# Altium project AD5941 Module.PrjPcb
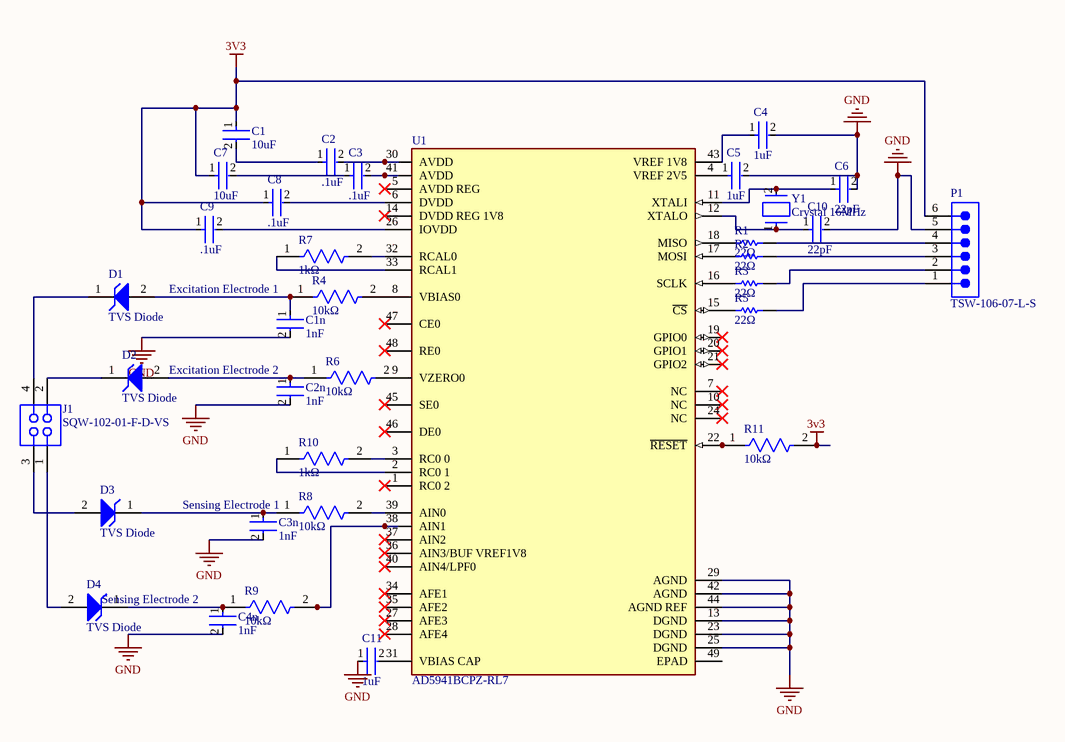
[diagram p0: AD5941 Module.SchDoc]
1 sheet, 34 parts. Net scope: global (net labels, ports and power ports of the same name join across sheets).
Board file: PCB1.PcbDoc

## Sheet AD5941 Module.SchDoc
size A; SheetNumber: 1; SheetTotal: 1

### Parts
C1  10uF  [FP-CC0603-DB-MFG]
C1n  1nF  [FP-0805-L_2_01_0_2-W_1_25-IPC_A]
C2  .1uF  [FP-C0402-BB-MFG]
C2n  1nF  [FP-0805-L_2_01_0_2-W_1_25-IPC_A]
C3  .1uF  [FP-C0402-BB-MFG]
C3n  1nF  [FP-0805-L_2_01_0_2-W_1_25-IPC_A]
C4  1uF  [FP-C0402C105K8PACTU-MFG]
C4n  1nF  [FP-0805-L_2_01_0_2-W_1_25-IPC_A]
C5  1uF  [FP-C0402C105K8PACTU-MFG]
C6  22pF  [FP-C1206C-EB-MFG]
C7  10uF  [FP-CC0603-DB-MFG]
C8  .1uF  [FP-C0402-BB-MFG]
C9  .1uF  [FP-C0402-BB-MFG]
C10  22pF  [FP-C1206C-EB-MFG]
C11  1uF  [FP-C0402C105K8PACTU-MFG]
D1  TVS Diode  [ONSC-SOD-923-2-514AB-01_V]
D2  TVS Diode  [ONSC-SOD-923-2-514AB-01_V]
D3  TVS Diode  [ONSC-SOD-923-2-514AB-01_V]
D4  TVS Diode  [ONSC-SOD-923-2-514AB-01_V]
J1  SQW-102-01-F-D-VS  [SMTC-SQW-102-01-X-D-VS]
P1  TSW-106-07-L-S  [SMTC-TSW-106-07-X-S]
R1  22Ω  [RESC3216X60X45LL10T20]
R2  22Ω  [RESC3216X60X45LL10T20]
R3  22Ω  [RESC3216X60X45LL10T20]
R4  10kΩ  [FP-RT0603-MFG]
R5  22Ω  [RESC3216X60X45LL10T20]
R6  10kΩ  [FP-RT0603-MFG]
R7  1kΩ  [FP-RG3216-MFG]
R8  10kΩ  [FP-RT0603-MFG]
R9  10kΩ  [FP-RT0603-MFG]
R10  1kΩ  [FP-RG3216-MFG]
R11  10kΩ  [FP-RT0603-MFG]
U1  AD5941BCPZ-RL7  [FP-CP-48-4-IPC_C]
Y1  Crystal 16MHz  [FP-ABM7-MFG]

### Nets
3V3: C1.1 C7.1 C8.1 C9.1 P1.6 R11.2
GND: C1n.2 C2n.2 C3n.2 C4.2 C4n.2 C5.2 C6.2 C10.2 C11.1 P1.5 U1.13(DGND) U1.23(DGND) U1.25(DGND) U1.29(AGND) U1.42(AGND) U1.44(AGND_REF)
NetC1_2: C1.2 C2.1
NetC1n_1: C1n.1 D1.2(A) R4.1
NetC2_2: C2.2 U1.30(AVDD)
NetC2n_1: C2n.1 D2.2(A) R6.1
NetC3_1: C3.1 C7.2
NetC3_2: C3.2 U1.41(AVDD)
NetC3n_1: C3n.1 D3.1(K) R8.1
NetC4_1: C4.1 U1.43(VREF_1V8)
NetC4n_1: C4n.1 D4.1(K) R9.1
NetC5_1: C5.1 U1.4(VREF_2V5)
NetC6_1: C6.1 U1.11(XTALI) Y1.2
NetC8_2: C8.2 U1.6(DVDD)
NetC9_2: C9.2 U1.26(IOVDD)
NetC10_1: C10.1 U1.12(XTALO) Y1.1
NetC11_2: C11.2 U1.31(VBIAS_CAP)
NetD1_1: D1.1(K) J1.4
NetD2_1: D2.1(K) J1.2
NetD3_2: D3.2(A) J1.3
NetD4_2: D4.2(A) J1.1
NetP1_1: P1.1 R5.2
NetP1_2: P1.2 R3.2
NetP1_3: P1.3 R2.2
NetP1_4: P1.4 R1.2
NetR1_1: R1.1 U1.18(MISO)
NetR2_1: R2.1 U1.17(MOSI)
NetR3_1: R3.1 U1.16(SCLK)
NetR4_2: R4.2 U1.8(VBIAS0)
NetR5_1: R5.1 U1.15(~{CS})
NetR7_1: R7.1 U1.33(RCAL1)
NetR7_2: R7.2 U1.32(RCAL0)
NetR8_2: R8.2 U1.39(AIN0)
NetR9_2: R9.2 U1.38(AIN1)
NetR10_1: R10.1 U1.2(RC0_1)
NetR10_2: R10.2 U1.3(RC0_0)
NetR11_1: R11.1 U1.22(~{RESET})

Not connected (* = marked no-connect by the designer): R6 2; U1 1(RC0_2)* 5(AVDD_REG)* 7(NC)* 9(VZERO0) 10(NC)* 14(DVDD_REG_1V8)* 19(GPIO0)* 20(GPIO1)* 21(GPIO2)* 24(NC)* 27(AFE3)* 28(AFE4)* 34(AFE1)* 35(AFE2)* 36(AIN3/BUF_VREF1V8)* 37(AIN2)* 40(AIN4/LPF0)* 45(SE0)* 46(DE0)* 47(CE0)* 48(RE0)* 49(EPAD)

### Notes on the sheet
- Excitation Electrode 1
- (near C2n) Excitation Electrode 2
- Sensing Electrode 1
- (near D4) Sensing Electrode 2

### Library data of the parts
C1 C7 = CMP-1035-02797-2: CAP CER 10UF 6.3V X5R 0603; Dissipation Factor: 10%; Tolerance: 20%; Depth: 0.8mm; Dielectric: X5R; Height: 0.8mm; Min Operating Temperature: -55°C; Package Quantity: 4000; Radiation Hardening: No; Mount: Surface Mount; Termination: SMD/SMT; Case/Package: 0603; Max Operating Temperature: 85°C; Case Code (Imperial): 0603; RoHS Compliant: Yes; Number of Pins: 2; Lead Free: Lead Free; Resistor Type: Ceramic; Thickness: 0.039inch; Construction: Flat; Width: 0.031inch; Length: 1.6mm; Capacitance: 10uF; Voltage Rating: 6.3V; Series: CC; REACH SVHC: No SVHC; Packaging: Tape and Reel; Case Code (Metric): 1608; Voltage Rating (DC): 6.3V; Halogen Free: Halogen Free
C1n C2n C3n C4n = CMP-2007-04595-2: General Purpose Ceramic Capacitor, 0805, 1nF, 10%, X7R, 0.15, 200V; Insulation Resistance: 100GR; Lead Free: Lead Free; Height: 0.71mm; Voltage Rating: 200V; REACH SVHC: No SVHC; Mount: Surface Mount; RoHS Compliant: Yes; Thickness: 0.037inch; Package Quantity: 1; Series: -; Size: 0.94mm; Case/Package: 0805; Dielectric: X7R; Radiation Hardening: No; Construction: Flat; Length: 2.01mm; Width: 0.049inch; Contact Plating: Tin; Case Code (Imperial): 0805; Termination: SMD/SMT; Case Code (Metric): 2012; Number of Pins: 2; Dielectric Material: Ceramic; Packaging: Tape and Reel; Capacitance: 1nF; Min Operating Temperature: -55°C; Depth: 1.25mm; Voltage: 200V; Max Operating Temperature: 125°C; Tolerance: 10%; Voltage Rating (DC): 200V
C2 C3 C8 C9 = CMP-2008-02046-2: CAP CER 0.1UF 10V X5R 0402; Manufacturer: Kemet; Manufacturer Part Number: C0402C104K8PACTU; Material: Ceramic; Capacitance: 0.10 μF; Temperature Coefficient: 15%; Description: C0402 0.10 μF X5R 10.00% 10 V; Tolerance: 0.1; Value: 0.10 μF; Package: C0402-BB; Temperature: -55°C to +125°C; ComponentLink2Description: Datasheet; Temperature Characteristic: X5R; Device Class L1: Passive Components; Height: 0.55mm; Lead Free: Yes; ComponentLink2URL: https://content.kemet.com/datasheets/KEM_C1002_X7R_SMD.pdf; Device Class L2: Capacitors; Temperature Range Low: -55°C; Temperature Range High: +125°C; RoHS: TRUE; Octopart: https://octopart.com/c0402c104k8pactu-kemet-140039; Automotive: No; Mouser Description: Capacitor 100 nF 10 VDC 0402; Category: Cap; Voltage Rating: 10 V; Digikey Description: CAP CER 0.1UF 10V X5R 0402; Ipc Land Pattern Name: CAPC10050X50; Device Class L3: Ceramic Capacitors
C4 C5 C11 = CMP-2008-02081-2: CAP CER 1UF 10V X5R 0402; Dielectric Material: Ceramic; Dissipation Factor: 5%; Tolerance: 10%; Number of Pins: 2; Contact Plating: Tin; Min Operating Temperature: -55°C; Termination: SMD/SMT; Lead Free: Lead Free; Construction: Flat; Voltage Rating (DC): 10V; Mount: Surface Mount; Series: C; Thickness: 0.022inch; Width: 0.5mm; Radiation Hardening: No; Capacitance: 1uF; Dielectric: X5R; Height: 0.5mm; Voltage: 10V; Length: 1mm; Depth: 0.5mm; Max Operating Temperature: 85°C; Package Quantity: 1; Packaging: Tape and Reel; RoHS Compliant: Yes; Case Code (Imperial): 0402; Case Code (Metric): 1005; REACH SVHC: No SVHC; Voltage Rating: 10V; Case/Package: 0402
C6 C10 = CMP-1037-00978-2: 1206 22pF Ceramic Multilayer Capacitor; 50VDC; 125degC; C0G Dielec; +/-5% SMD; Manufacturer Part Number: C1206C220J5GACTU; Manufacturer: KEMET; Description: C1206 22 pF C0G 5.00% 50 V; Automotive Grade: Grade 0; Temperature Coefficient: 15%; Tolerance: 0.05; Voltage Rating: 50 V; Height: 0.88mm; Mouser Description: 1206 22pF Ceramic Multilayer Capacitor; 50VDC; 125degC; C0G Dielec; +/-5% SMD; Ipc Land Pattern Name: CAPC320160X78; Temperature Range High: +150°C; Automotive: Yes; Device Class L3: Ceramic Capacitors; ComponentLink2Description: Datasheet; Temperature: -55°C to +150°C; Lead Free: Yes; Category: Cap; Device Class L2: Capacitors; Device Class L1: Passive Components; Value: 22 pF; Capacitance: 22 pF; Digikey Description: 1206 22pF Ceramic Multilayer Capacitor; 50VDC; 125degC; C0G Dielec; +/-5% SMD; Octopart: https://octopart.com/c1206c220j5gactu-kemet-131912; Material: Ceramic; Temperature Characteristic: C0G; Package: C1206C-EB; RoHS: TRUE; ComponentLink2URL: https://content.kemet.com/datasheets/KEM_C1007_X8R_ULTRA_150C_SMD.pdf; Temperature Range Low: -55°C
D1-D4 = CMP-1063-00117-1: Transient Voltage Suppressor, ESD Protection Diode with Ultra-Low Leakage, 2-Pin SOD-923, Pb-Free, Tape and Reel; Manufacturer: On Semiconductor; PartNumber: ESD9R3.3ST5G; C Max (pF): 0.9; V(BR) Min (V): 4.8; Number of Lines: 1; Direction: Unidirectional; IR Max (uA): 0.001; VRWM Max (V): 3.3; PackageReference: SOD-923-2-514AB-01; ComponentLink3URL: http://www.onsemi.com/pub_link/Collateral/514AB.PDF; DatasheetVersion: Rev. 1; PackageDescription: 2-Pin SOD, Body 0.8 x 0.6 mm; ComponentLink1URL: http://www.onsemi.com/; ComponentLink2Description: Datasheet; ComponentLink3Description: Package Specification; Packing: Tape and Reel; ComponentLink1Description: Manufacturer URL; ComponentLink2URL: http://www.onsemi.com/pub_link/Collateral/ESD9R3.3S-D.PDF; RoHS: Pb-Free; PackageVersion: Rev. C, 03/2011; Mounting Technology: Surface Mount
J1 = CMP-1021-00107-1: Cost-Effective Rugged Socket, Surface Mount, Vertical, -55 to 125 degC, 2 mm Pitch, 4-Pin, Female, RoHS; Manufacturer: Samtec; Pitch: 2 mm; ComponentLink2URL: http://www.samtec.com/documents/webfiles/pdf/SQW.PDF; RoHS: True; ComponentLink2Description: Datasheet; ComponentLink3URL: http://www.samtec.com/documents/webfiles/cpdf/SQW-1XX-01-XXX-D-VS-XX-XXX-MKT.pdf; Temperature Range: -55 to 125 degC; PackageReference: SQW-102-01-X-D-VS; PartNumber: SQW-102-01-F-D-VS; Orientation: Vertical; Mounting Technology: Surface Mount; ComponentLink1URL: http://www.samtec.com; DatasheetVersion: F-214; ComponentLink3Description: Package Specification; PackageVersion: AI, 4/1997; ComponentLink1Description: Manufacturer URL; PackageDescription: 2mm Sockets Trip Assembly
P1 = CMP-1024-00386-1: 0.025" SQ Post Header, Through-hole, Vertical, -55 to 125 degC, 2.54 mm Pitch, 6-Pin, Male, RoHS; Manufacturer: Samtec; Pitch: 2.54 mm; RoHS: True; PartNumber: TSW-106-07-L-S; Orientation: Vertical; PackageReference: TSW-106-07-X-S; PackageDescription: .025[0.64] SQ. Post Terminal Strip Assembly; DatasheetVersion: F-214; ComponentLink3Description: Package Specification; Mounting Technology: Through-hole; ComponentLink2Description: Datasheet; PackageVersion: DM, 8/1988; ComponentLink3URL: http://www.samtec.com/documents/webfiles/cpdf/TSW-XXX-XX-XXX-X-XX-XXX-MKT.pdf; Temperature Range: -55 to 125 degC; ComponentLink2URL: http://www.samtec.com/documents/webfiles/pdf/TSW_TH.PDF; ComponentLink1Description: Manufacturer URL; ComponentLink1URL: http://www.samtec.com
R1-R3 R5 = CMP-1014-00034-2: Part Number: CRCW120622R0JNEA; Manufacturer: Vishay Dale
R4 R6 R8 R9 R11 = CMP-03412-005349-1: RES SMD 10K OHM 1% 1/10W 0603; Manufacturer: Yageo; Manufacturer Part Number: RT0603FRE0710KL; Temperature Coefficient: 50 ppm/°C; Power Rating: 0.1W; Tolerance: 0.01; Description: RT0603 10KΩ 0.1W 50 ppm/°C 1.00%; Voltage Rating: 75V; RoHS: TRUE; Category: Res; Value: 10KΩ; Automotive: No; Digikey Description: RES SMD 10K OHM 1% 1/10W 0603; ComponentLink2Description: Datasheet; Octopart: https://octopart.com/rt0603fre0710kl-yageo-40009243; ComponentLink2URL: http://www.yageo.com/documents/recent/PYu-RT_1-to-0.01_RoHS_L_9.pdf; Device Class L3: Chip SMD Resistors; Device Class L1: Passive Components; Temperature Range High: +155°C; Height: 0.55mm; Composition: Thin Film; Ipc Land Pattern Name: RESC16080X45; Series: RT; Package: RT0603; Resistance: 10KΩ; Footprint Url: http://www.yageo.com/exep/pages/download/literatures/PYu-R_Mount_10.pdf; Temperature: -55°C to +155°C; Temperature Range Low: -55°C; Lead Free: Yes; Device Class L2: Resistors; Mouser Description: Thin Film Resistors - SMD 10K ohm 1% 1/10W
R7 R10 = CMP-2003-02638-2: Automotive Metal Thin Film Chip Resistor, 1206, 1kΩ, 0.1%, 25ppm/°C, 0.25W, 200V; Power Rating: 250mW; Resistance: 1kR; Features: Automotive AEC-Q200; Voltage Rating: 200V; Tolerance: 0.1%; Series: RG; Case Code (Metric): 3216; Weight: 0.000571oz; Voltage Rating (DC): 200V; Width: 1.6mm; Max Operating Temperature: 155°C; Min Operating Temperature: -55°C; Lead Free: Lead Free; Number of Terminations: 2; RoHS Compliant: Yes; Temperature Coefficient: 25ppm/°C; Resistor Type: Thin Film; Height: 0.4mm; Length: 3.2mm; Termination: SMD/SMT; Max Power Dissipation: 250mW; Size Code: 1206; Case Code (Imperial): 1206; Packaging: Tape and Reel; Case/Package: 1206
U1 = CMP-09085-000008-1: BIO-IMPEDANCE & ELECTROCHEMICAL; RoHS Compliant: Yes
Y1 = CMP-27762-000095-1: Crystal 16MHz ±20ppm 18pF SMD-2 6mm x 3.5mm; ESR (Equivalent Series Resistance): 50R; Frequency Stability: 30ppm; Width: 3.3mm; Frequency: 16MHz; Radiation Hardening: No; Height: 0.055inch; Tolerance: 20ppm; Length: 6mm; Case/Package: CSMD; Lead Free: Lead Free; Min Operating Temperature: -40°C; Termination: SMD/SMT; Operating Frequency: 16 MHz; Resistor Type: Ceramic; Packaging: Tape and Reel; Mount: Surface Mount; Load Capacitance: 18pF; Frequency Tolerance: 20ppm; Depth: 3.5mm; Series: ABM7; Package Quantity: 1000; Max Operating Temperature: 85°C; Number of Pins: 2